# Altium schematic sheet 0173_IMVP VCCCORE_SOC_ .SchDoc
size 848 x 558 mm
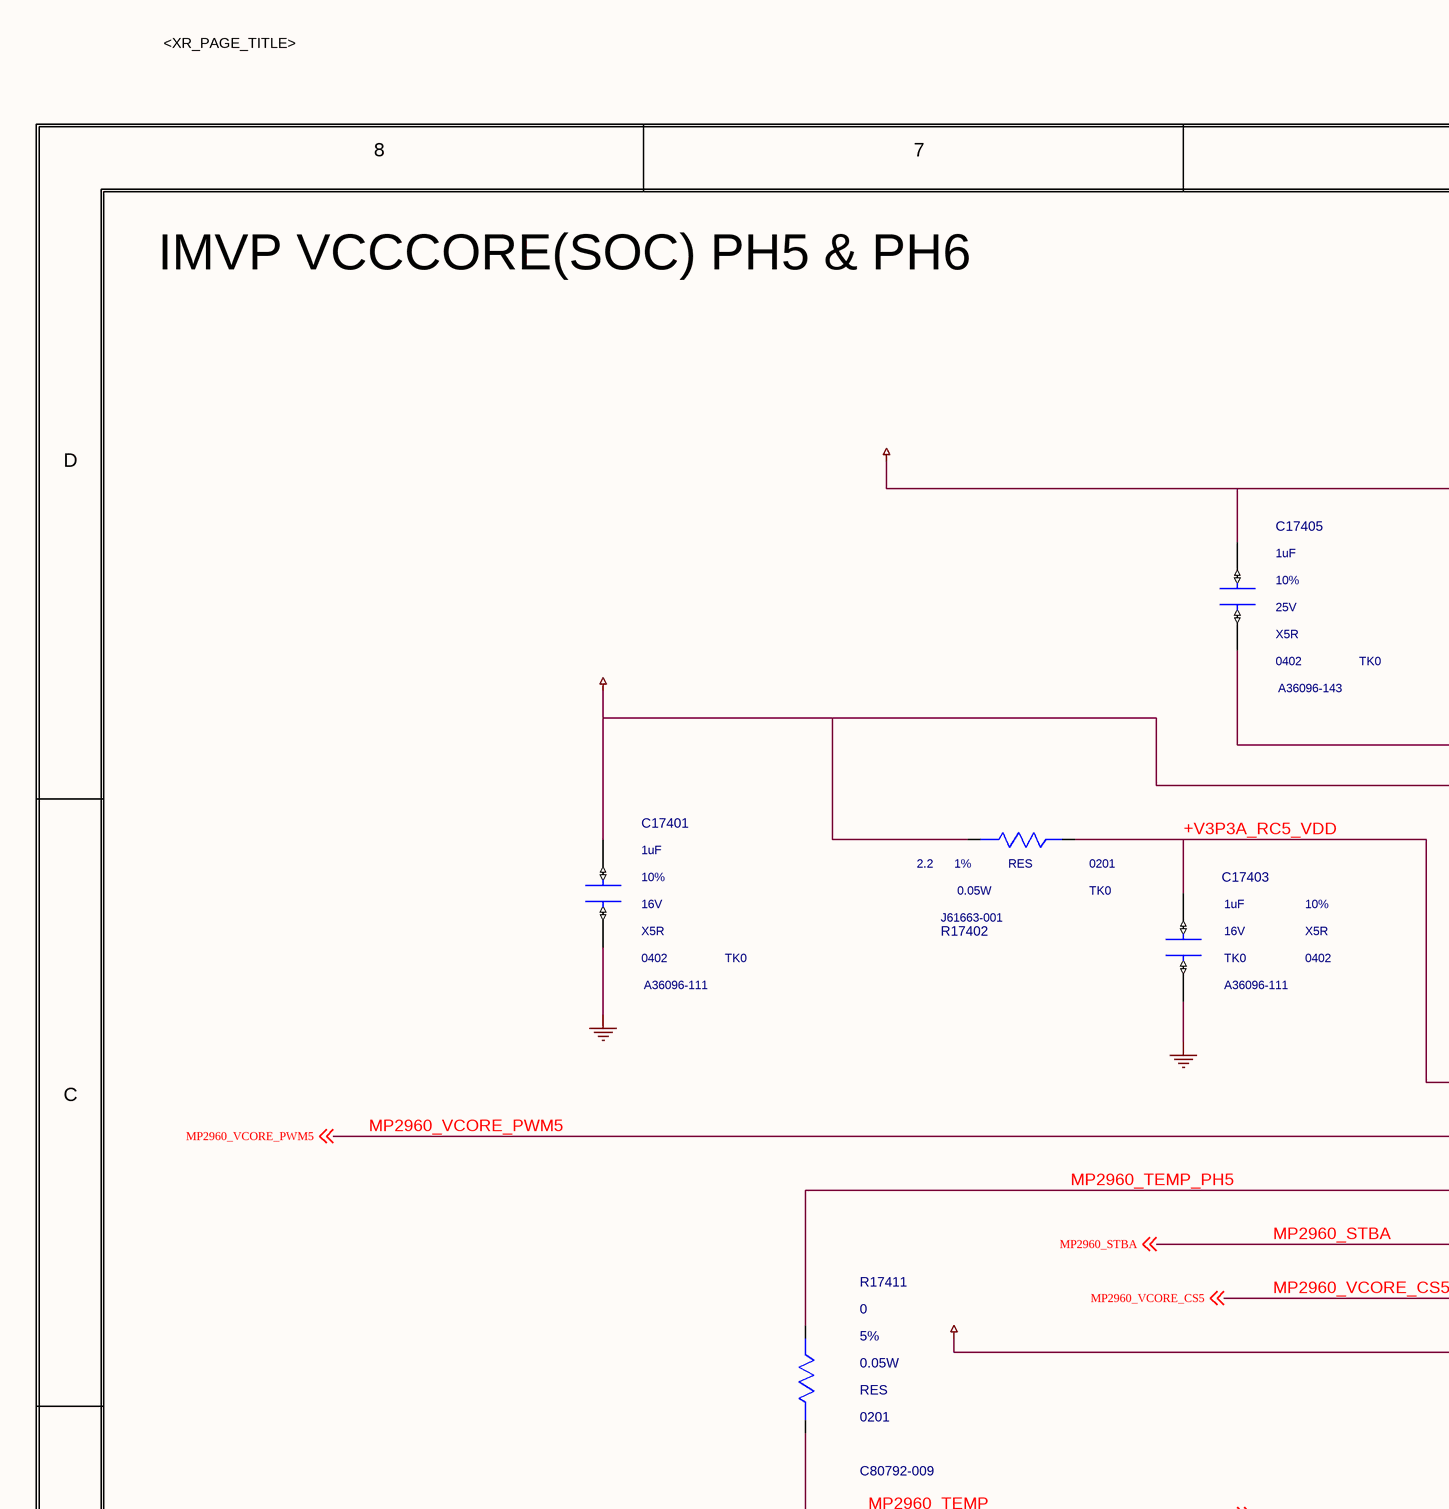
[diagram p0: 0173_IMVP VCCCORE_SOC_ .SchDoc, top left]
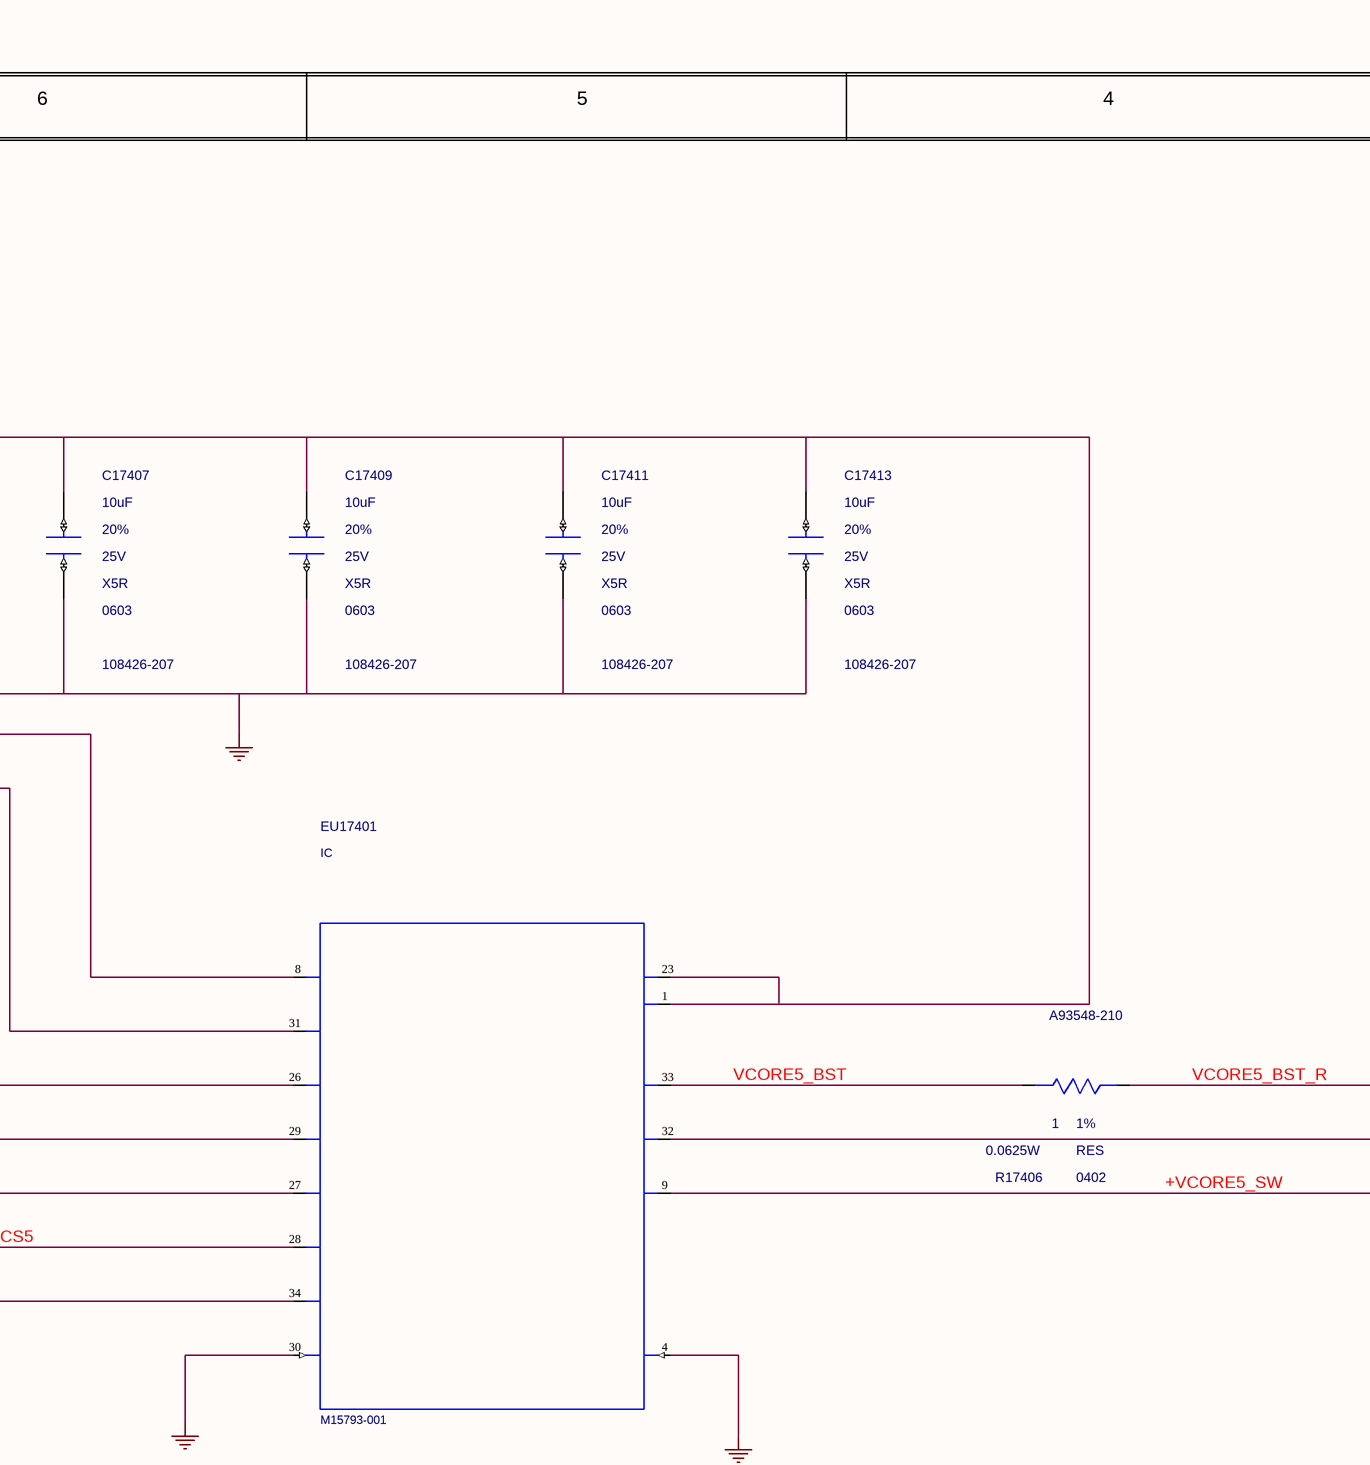
[diagram p1: 0173_IMVP VCCCORE_SOC_ .SchDoc, top middle]
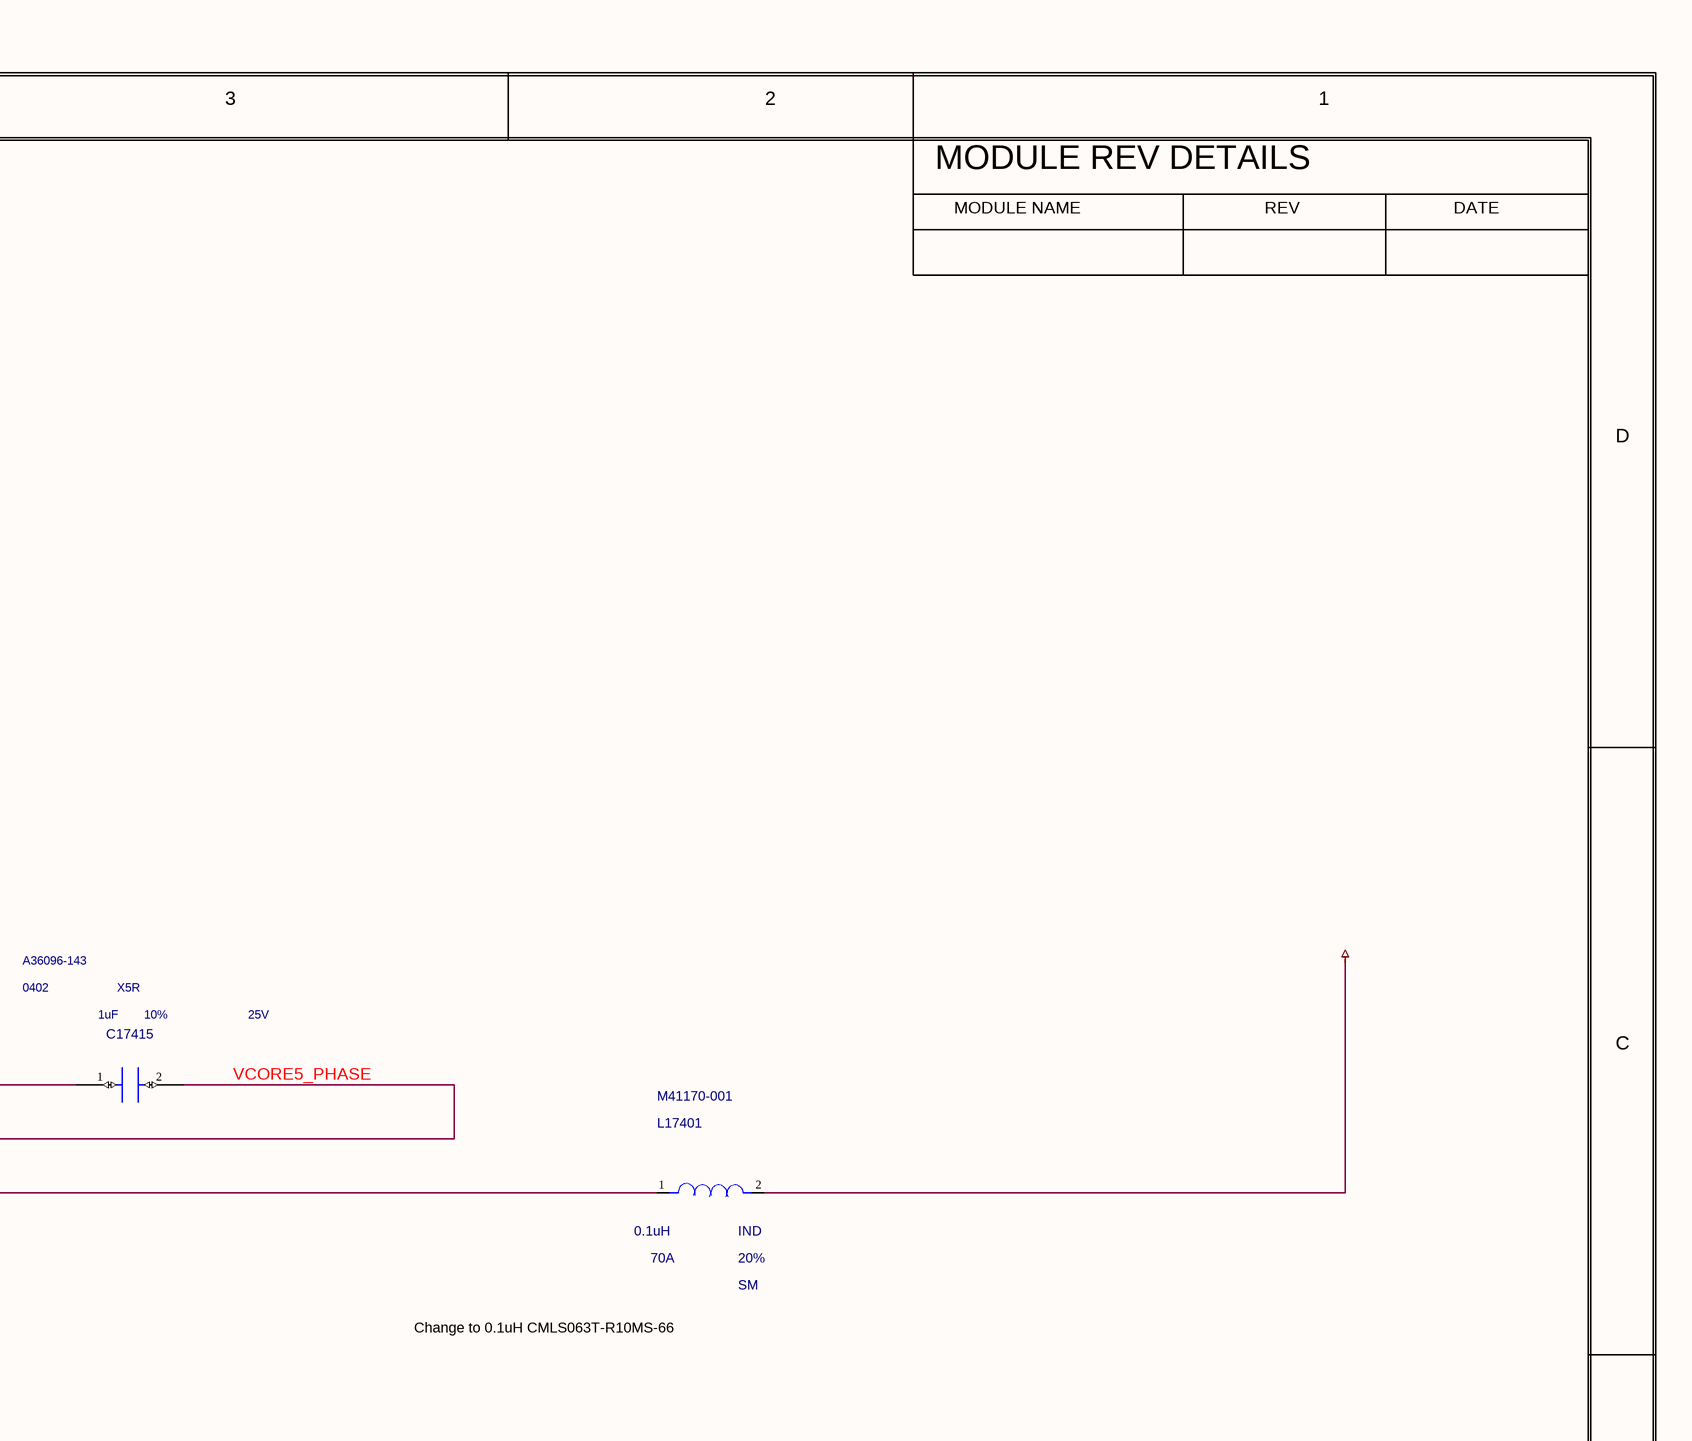
[diagram p2: 0173_IMVP VCCCORE_SOC_ .SchDoc, top right]
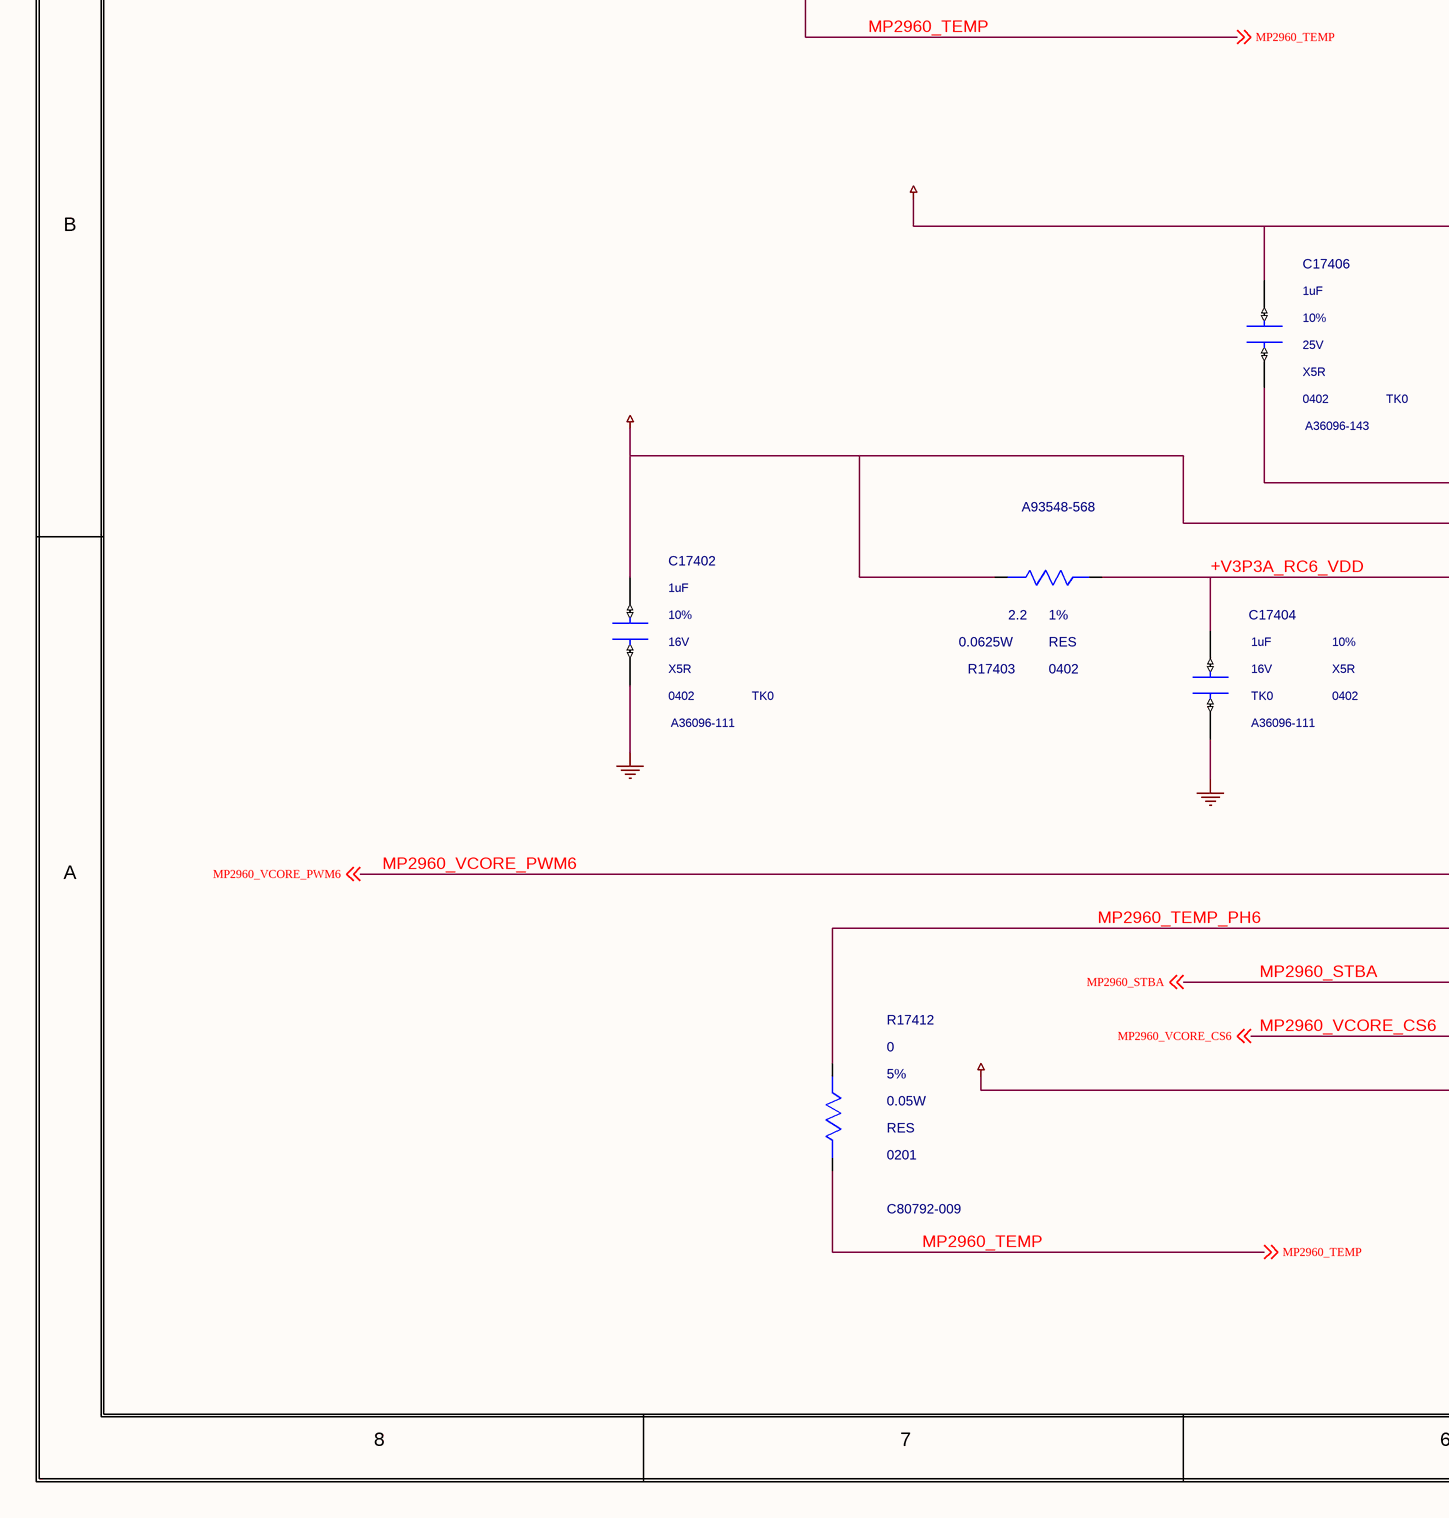
[diagram p3: 0173_IMVP VCCCORE_SOC_ .SchDoc, bottom left]
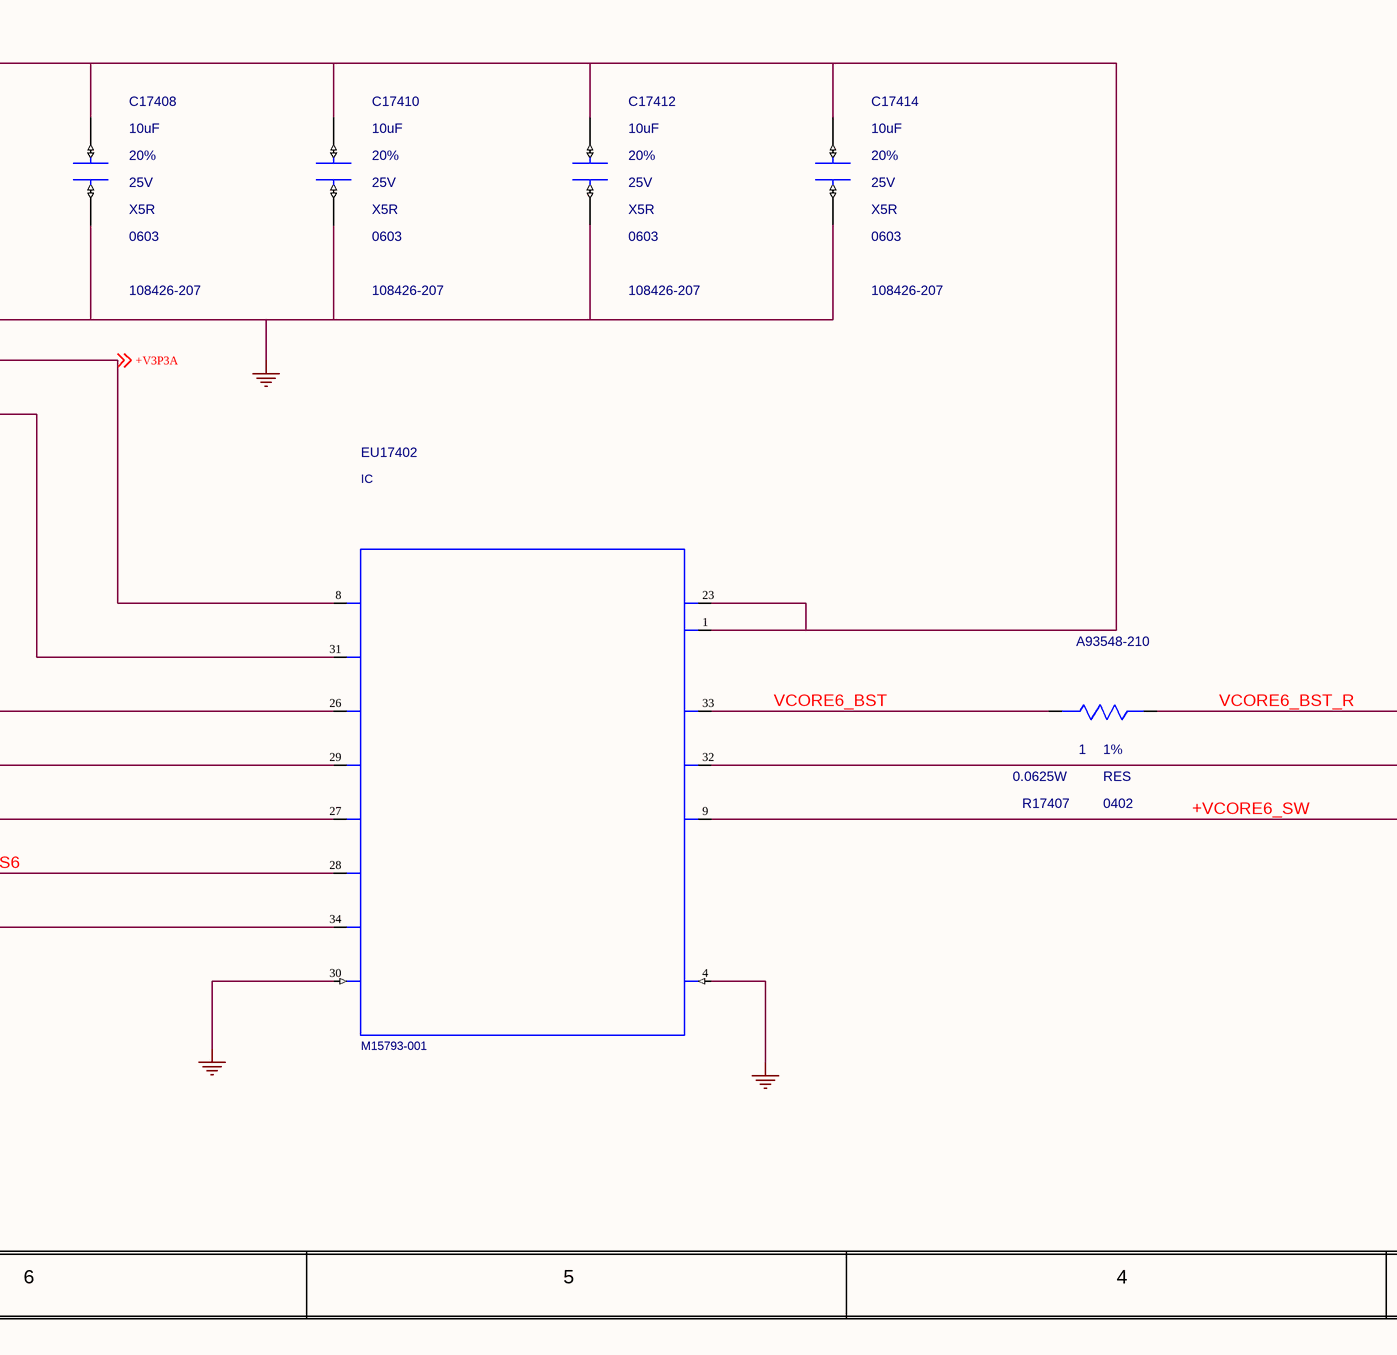
[diagram p4: 0173_IMVP VCCCORE_SOC_ .SchDoc, bottom middle]
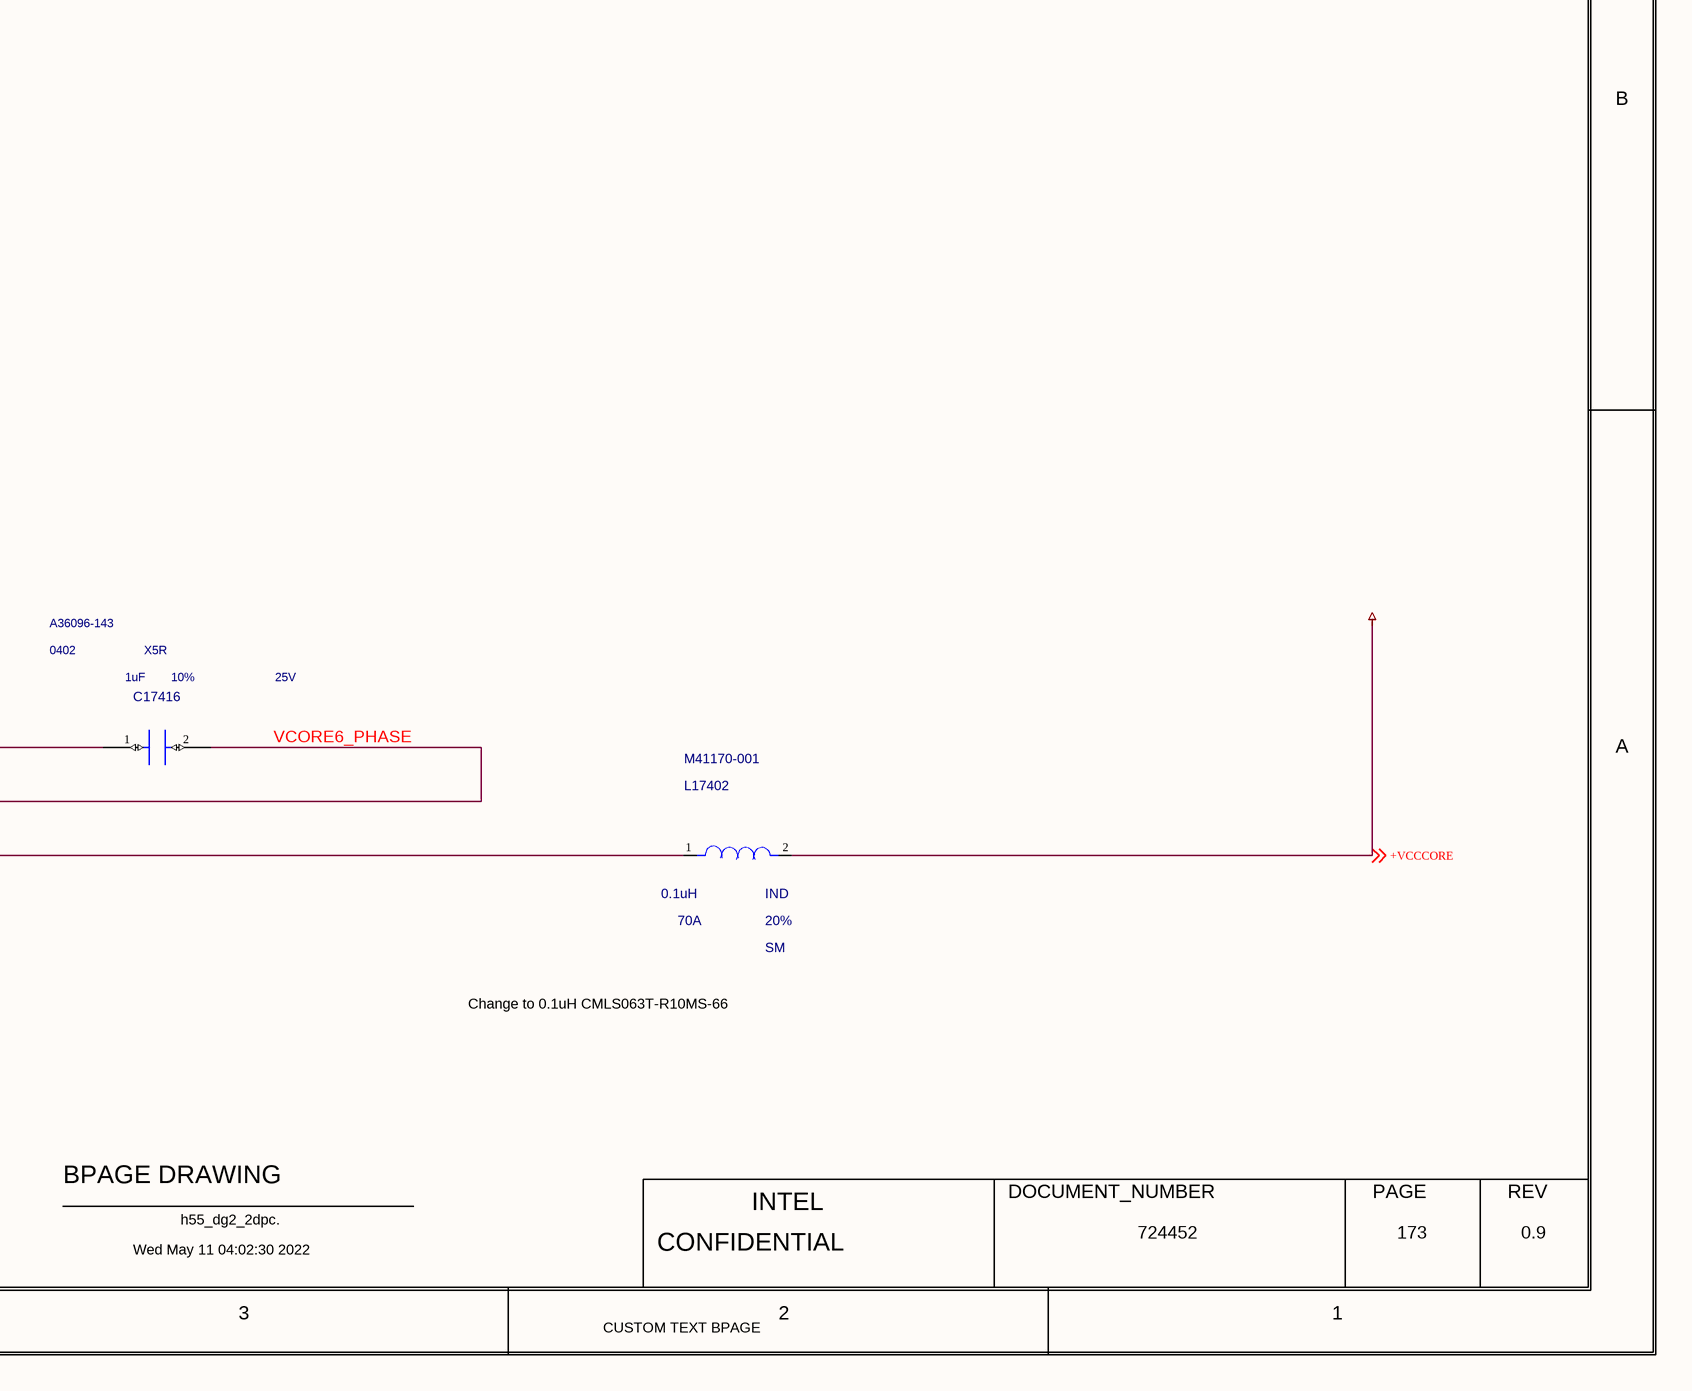
[diagram p5: 0173_IMVP VCCCORE_SOC_ .SchDoc, bottom right]

## Parts
C17401  1uF  FP_TECH: TK0  MATERIAL: X5R  PACK_TYPE: 0402  PART_NUMBER: A36096-111  TOLERANCE: 10%  VOLTAGE: 16V  [CTK0_SM0402_1050X550_MA]
C17402  1uF  FP_TECH: TK0  MATERIAL: X5R  PACK_TYPE: 0402  PART_NUMBER: A36096-111  TOLERANCE: 10%  VOLTAGE: 16V  [CTK0_SM0402_1050X550_MA]
C17403  1uF  FP_TECH: TK0  MATERIAL: X5R  PACK_TYPE: 0402  PART_NUMBER: A36096-111  TOLERANCE: 10%  VOLTAGE: 16V  [CTK0_SM0402_1050X550_MA]
C17404  1uF  FP_TECH: TK0  MATERIAL: X5R  PACK_TYPE: 0402  PART_NUMBER: A36096-111  TOLERANCE: 10%  VOLTAGE: 16V  [CTK0_SM0402_1050X550_MA]
C17405  1uF  FP_TECH: TK0  MATERIAL: X5R  PACK_TYPE: 0402  PART_NUMBER: A36096-143  TOLERANCE: 10%  VOLTAGE: 25V  [CTK0_SM0402_1050X550_MA]
C17406  1uF  FP_TECH: TK0  MATERIAL: X5R  PACK_TYPE: 0402  PART_NUMBER: A36096-143  TOLERANCE: 10%  VOLTAGE: 25V  [CTK0_SM0402_1050X550_MA]
C17407  10uF  MATERIAL: X5R  PACK_TYPE: 0603  PART_NUMBER: 108426-207  TOLERANCE: 20%  VOLTAGE: 25V  [CTK2_SM0603_1800X1000_MA]
C17408  10uF  MATERIAL: X5R  PACK_TYPE: 0603  PART_NUMBER: 108426-207  TOLERANCE: 20%  VOLTAGE: 25V  [CTK2_SM0603_1800X1000_MA]
C17409  10uF  MATERIAL: X5R  PACK_TYPE: 0603  PART_NUMBER: 108426-207  TOLERANCE: 20%  VOLTAGE: 25V  [CTK2_SM0603_1800X1000_MA]
C17410  10uF  MATERIAL: X5R  PACK_TYPE: 0603  PART_NUMBER: 108426-207  TOLERANCE: 20%  VOLTAGE: 25V  [CTK2_SM0603_1800X1000_MA]
C17411  10uF  MATERIAL: X5R  PACK_TYPE: 0603  PART_NUMBER: 108426-207  TOLERANCE: 20%  VOLTAGE: 25V  [CTK2_SM0603_1800X1000_MA]
C17412  10uF  MATERIAL: X5R  PACK_TYPE: 0603  PART_NUMBER: 108426-207  TOLERANCE: 20%  VOLTAGE: 25V  [CTK2_SM0603_1800X1000_MA]
C17413  10uF  MATERIAL: X5R  PACK_TYPE: 0603  PART_NUMBER: 108426-207  TOLERANCE: 20%  VOLTAGE: 25V  [CTK2_SM0603_1800X1000_MA]
C17414  10uF  MATERIAL: X5R  PACK_TYPE: 0603  PART_NUMBER: 108426-207  TOLERANCE: 20%  VOLTAGE: 25V  [CTK2_SM0603_1800X1000_MA]
C17415  1uF  MATERIAL: X5R  PACK_TYPE: 0402  PART_NUMBER: A36096-143  TOLERANCE: 10%  VOLTAGE: 25V  [SMC0402MA]
C17416  1uF  MATERIAL: X5R  PACK_TYPE: 0402  PART_NUMBER: A36096-143  TOLERANCE: 10%  VOLTAGE: 25V  [SMC0402MA]
EU17401  MATERIAL: IC  PART_NUMBER: M15793-001  [CTK1_LCC34_4100X6100_450_DF4P_MA_VR]  (hidden comment: C_MP86959)
EU17402  MATERIAL: IC  PART_NUMBER: M15793-001  [CTK1_LCC34_4100X6100_450_DF4P_MA_VR]  (hidden comment: C_MP86959)
L17401  0.1uH  CURRENT: 70A  MATERIAL: IND  PACK_TYPE: SM  PART_NUMBER: M41170-001  TOLERANCE: 20%  [CTK2_SM_7300X6800_MA]
L17402  0.1uH  CURRENT: 70A  MATERIAL: IND  PACK_TYPE: SM  PART_NUMBER: M41170-001  TOLERANCE: 20%  [CTK2_SM_7300X6800_MA]
R17402  2.2  FP_TECH: TK0  MATERIAL: RES  PACK_TYPE: 0201  PART_NUMBER: J61663-001  TOLERANCE: 1%  WATTAGE: 0.05W  [CTK0_SM0201_630X330_MA]
R17403  2.2  MATERIAL: RES  PACK_TYPE: 0402  PART_NUMBER: A93548-568  TOLERANCE: 1%  WATTAGE: 0.0625W  [CTK2_SM0402_1100X550_MA]
R17406  1  MATERIAL: RES  PACK_TYPE: 0402  PART_NUMBER: A93548-210  TOLERANCE: 1%  WATTAGE: 0.0625W  [CTK0_SM0402_1100X550_MA]
R17407  1  MATERIAL: RES  PACK_TYPE: 0402  PART_NUMBER: A93548-210  TOLERANCE: 1%  WATTAGE: 0.0625W  [CTK0_SM0402_1100X550_MA]
R17411  0  MATERIAL: RES  PACK_TYPE: 0201  PART_NUMBER: C80792-009  TOLERANCE: 5%  WATTAGE: 0.05W  [CTK0_SM0201_630X330_MA]
R17412  0  MATERIAL: RES  PACK_TYPE: 0201  PART_NUMBER: C80792-009  TOLERANCE: 5%  WATTAGE: 0.05W  [CTK0_SM0201_630X330_MA]

## Nets
+V3P3A: C17401.1(A) C17402.1(A) EU17401.8(VDRV) EU17401.34(TEST) EU17402.8(VDRV) EU17402.34(TEST) R17402.1(A) R17403.1(A) ; off-sheet +V3P3A
+VBATA_VCCIN: C17405.1(A) C17406.1(A) C17407.1(A) C17408.1(A) C17409.1(A) C17410.1(A) C17411.1(A) C17412.1(A) C17413.1(A) C17414.1(A) EU17401.1(VIN_1) EU17401.23(VIN_2) EU17402.1(VIN_1) EU17402.23(VIN_2)
+VCCCORE: L17401.2(INB) L17402.2(INB) ; off-sheet +VCCCORE
GND: C17401.2(B) C17402.2(B) C17403.2(B) C17404.2(B) C17405.2(B) C17406.2(B) C17407.2(B) C17408.2(B) C17409.2(B) C17410.2(B) C17411.2(B) C17412.2(B) C17413.2(B) C17414.2(B) EU17401.4(PGND) EU17401.30(AGND) EU17402.4(PGND) EU17402.30(AGND)
+V3P3A_RC5_VDD: C17403.1(A) EU17401.31(VDD) R17402.2(B)
+V3P3A_RC6_VDD: C17404.1(A) EU17402.31(VDD) R17403.2(B)
+VCORE5_SW: EU17401.9(SW) L17401.1(INA)
+VCORE6_SW: EU17402.9(SW) L17402.1(INA)
MP2960_STBA: EU17401.27(SYNC) EU17402.27(SYNC) ; off-sheet MP2960_STBA
MP2960_TEMP: R17411.2(B) R17412.2(B) ; off-sheet MP2960_TEMP
MP2960_TEMP_PH5: EU17401.29(VTEMP_FLT) R17411.1(A)
MP2960_TEMP_PH6: EU17402.29(VTEMP_FLT) R17412.1(A)
MP2960_VCORE_CS5: EU17401.28(CS) ; off-sheet MP2960_VCORE_CS5
MP2960_VCORE_CS6: EU17402.28(CS) ; off-sheet MP2960_VCORE_CS6
MP2960_VCORE_PWM5: EU17401.26(PWM) ; off-sheet MP2960_VCORE_PWM5
MP2960_VCORE_PWM6: EU17402.26(PWM) ; off-sheet MP2960_VCORE_PWM6
VCORE5_BST: EU17401.33(BST) R17406.1(A)
VCORE5_BST_R: C17415.1(A) R17406.2(B)
VCORE5_PHASE: C17415.2(B) EU17401.32(PHASE)
VCORE6_BST: EU17402.33(BST) R17407.1(A)
VCORE6_BST_R: C17416.1(A) R17407.2(B)
VCORE6_PHASE: C17416.2(B) EU17402.32(PHASE)

## Notes on the sheet
- <XR_PAGE_TITLE>
- 8
- 7
- 6
- 5
- 4
- 3
- 2
- 1
- MODULE REV DETAILS
- IMVP VCCCORE(SOC) PH5 & PH6
- MODULE NAME
- REV
- DATE
- D
- C
- Change to 0.1uH CMLS063T-R10MS-66
- B
- A
- BPAGE DRAWING
- INTEL
- DOCUMENT_NUMBER
- PAGE
- Wed May 11 04:02:30 2022
- h55_dg2_2dpc.
- CONFIDENTIAL
- 724452
- 173
- 0.9
- CUSTOM TEXT BPAGE

## Library data of the parts
C17401 = C_CAP: CDS_PHYS_PART_NAME: C_CAP_0402-A36096-111,X5R,1UF,16V,10%,TK0,GENERIC; CDS_LMAN_SYM_OUTLINE: -50,50,50,-50; IP: GENERIC; ROOM: NONE; OriginalSymbolOrigin: (-50,25); XY: (-2000,3475); VER: 1; ROT: 0; PHYS_PAGE: 173; LOCATION: C17401; DRAWING: @RVP1_ADL_SB_ADP_S_DDR5_SODIMM_2DPC_LIB.H55_DG2_2DPC(SCH_1):PAGE542; CDS_LIB: c_discrete; VARIANT: ?; PCB Footprint: CTK0_SM0402_1050X550_MA; CHIPS_PART_NAME: C_CAP; CDS_PART_NAME: C_CAP_0402-A36096-111,X5R,1UF,16V,10%,TK0,GENERIC; CDS_LOCATION: C17401
C17402 = C_CAP: CDS_PHYS_PART_NAME: C_CAP_0402-A36096-111,X5R,1UF,16V,10%,TK0,GENERIC; CDS_LMAN_SYM_OUTLINE: -50,50,50,-50; IP: GENERIC; ROOM: NONE; OriginalSymbolOrigin: (-50,25); XY: (-1950,1225); VER: 1; ROT: 0; PHYS_PAGE: 173; LOCATION: C17402; DRAWING: @RVP1_ADL_SB_ADP_S_DDR5_SODIMM_2DPC_LIB.H55_DG2_2DPC(SCH_1):PAGE542; CDS_LIB: c_discrete; VARIANT: ?; PCB Footprint: CTK0_SM0402_1050X550_MA; CHIPS_PART_NAME: C_CAP; CDS_PART_NAME: C_CAP_0402-A36096-111,X5R,1UF,16V,10%,TK0,GENERIC; CDS_LOCATION: C17402
C17403 = C_CAP: CDS_PHYS_PART_NAME: C_CAP_0402-A36096-111,X5R,1UF,16V,10%,TK0,GENERIC; CDS_LMAN_SYM_OUTLINE: -50,50,50,-50; IP: GENERIC; ROOM: NONE; OriginalSymbolOrigin: (-50,25); XY: (-925,3375); VER: 1; ROT: 0; PHYS_PAGE: 173; LOCATION: C17403; DRAWING: @RVP1_ADL_SB_ADP_S_DDR5_SODIMM_2DPC_LIB.H55_DG2_2DPC(SCH_1):PAGE542; CDS_LIB: c_discrete; VARIANT: ?; PCB Footprint: CTK0_SM0402_1050X550_MA; CHIPS_PART_NAME: C_CAP; CDS_PART_NAME: C_CAP_0402-A36096-111,X5R,1UF,16V,10%,TK0,GENERIC; CDS_LOCATION: C17403
C17404 = C_CAP: CDS_PHYS_PART_NAME: C_CAP_0402-A36096-111,X5R,1UF,16V,10%,TK0,GENERIC; CDS_LMAN_SYM_OUTLINE: -50,50,50,-50; IP: GENERIC; ROOM: NONE; OriginalSymbolOrigin: (-50,25); XY: (-875,1125); VER: 1; ROT: 0; PHYS_PAGE: 173; LOCATION: C17404; DRAWING: @RVP1_ADL_SB_ADP_S_DDR5_SODIMM_2DPC_LIB.H55_DG2_2DPC(SCH_1):PAGE542; CDS_LIB: c_discrete; VARIANT: ?; PCB Footprint: CTK0_SM0402_1050X550_MA; CHIPS_PART_NAME: C_CAP; CDS_PART_NAME: C_CAP_0402-A36096-111,X5R,1UF,16V,10%,TK0,GENERIC; CDS_LOCATION: C17404
C17405 = C_CAP: CDS_PHYS_PART_NAME: C_CAP_0402-A36096-143,X5R,1UF,25V,10%,TK0,GENERIC; CDS_LMAN_SYM_OUTLINE: -50,50,50,-50; IP: GENERIC; ROOM: NONE; OriginalSymbolOrigin: (-50,25); XY: (-825,4025); VER: 1; ROT: 0; PHYS_PAGE: 173; LOCATION: C17405; DRAWING: @RVP1_ADL_SB_ADP_S_DDR5_SODIMM_2DPC_LIB.H55_DG2_2DPC(SCH_1):PAGE542; CDS_LIB: c_discrete; VARIANT: ?; PCB Footprint: CTK0_SM0402_1050X550_MA; CHIPS_PART_NAME: C_CAP; CDS_PART_NAME: C_CAP_0402-A36096-143,X5R,1UF,25V,10%,TK0,GENERIC; CDS_LOCATION: C17405
C17406 = C_CAP: CDS_PHYS_PART_NAME: C_CAP_0402-A36096-143,X5R,1UF,25V,10%,TK0,GENERIC; CDS_LMAN_SYM_OUTLINE: -50,50,50,-50; IP: GENERIC; ROOM: NONE; OriginalSymbolOrigin: (-50,25); XY: (-775,1775); VER: 1; ROT: 0; PHYS_PAGE: 173; LOCATION: C17406; DRAWING: @RVP1_ADL_SB_ADP_S_DDR5_SODIMM_2DPC_LIB.H55_DG2_2DPC(SCH_1):PAGE542; CDS_LIB: c_discrete; VARIANT: ?; PCB Footprint: CTK0_SM0402_1050X550_MA; CHIPS_PART_NAME: C_CAP; CDS_PART_NAME: C_CAP_0402-A36096-143,X5R,1UF,25V,10%,TK0,GENERIC; CDS_LOCATION: C17406
C17407 = C_CAP: CDS_PHYS_PART_NAME: C_CAP_0603-108426-207,X5R,10UF,25V,20%,TK2,GENERIC; CDS_LMAN_SYM_OUTLINE: -50,50,50,-50; FP_TECH: TK2; IP: GENERIC; ROOM: NONE; OriginalSymbolOrigin: (-50,25); XY: (-375,4025); VER: 1; ROT: 0; PHYS_PAGE: 173; LOCATION: C17407; DRAWING: @RVP1_ADL_SB_ADP_S_DDR5_SODIMM_2DPC_LIB.H55_DG2_2DPC(SCH_1):PAGE542; CDS_LIB: c_discrete; VARIANT: ?; PCB Footprint: CTK2_SM0603_1800X1000_MA; CHIPS_PART_NAME: C_CAP; CDS_PART_NAME: C_CAP_0603-108426-207,X5R,10UF,25V,20%,TK2,GENERIC; CDS_LOCATION: C17407
C17408 = C_CAP: CDS_PHYS_PART_NAME: C_CAP_0603-108426-207,X5R,10UF,25V,20%,TK2,GENERIC; CDS_LMAN_SYM_OUTLINE: -50,50,50,-50; FP_TECH: TK2; IP: GENERIC; ROOM: NONE; OriginalSymbolOrigin: (-50,25); XY: (-325,1775); VER: 1; ROT: 0; PHYS_PAGE: 173; LOCATION: C17408; DRAWING: @RVP1_ADL_SB_ADP_S_DDR5_SODIMM_2DPC_LIB.H55_DG2_2DPC(SCH_1):PAGE542; CDS_LIB: c_discrete; VARIANT: ?; PCB Footprint: CTK2_SM0603_1800X1000_MA; CHIPS_PART_NAME: C_CAP; CDS_PART_NAME: C_CAP_0603-108426-207,X5R,10UF,25V,20%,TK2,GENERIC; CDS_LOCATION: C17408
C17409 = C_CAP: CDS_PHYS_PART_NAME: C_CAP_0603-108426-207,X5R,10UF,25V,20%,TK2,GENERIC; CDS_LMAN_SYM_OUTLINE: -50,50,50,-50; FP_TECH: TK2; IP: GENERIC; ROOM: NONE; OriginalSymbolOrigin: (-50,25); XY: (75,4025); VER: 1; ROT: 0; PHYS_PAGE: 173; LOCATION: C17409; DRAWING: @RVP1_ADL_SB_ADP_S_DDR5_SODIMM_2DPC_LIB.H55_DG2_2DPC(SCH_1):PAGE542; CDS_LIB: c_discrete; VARIANT: ?; PCB Footprint: CTK2_SM0603_1800X1000_MA; CHIPS_PART_NAME: C_CAP; CDS_PART_NAME: C_CAP_0603-108426-207,X5R,10UF,25V,20%,TK2,GENERIC; CDS_LOCATION: C17409
C17410 = C_CAP: CDS_PHYS_PART_NAME: C_CAP_0603-108426-207,X5R,10UF,25V,20%,TK2,GENERIC; CDS_LMAN_SYM_OUTLINE: -50,50,50,-50; FP_TECH: TK2; IP: GENERIC; ROOM: NONE; OriginalSymbolOrigin: (-50,25); XY: (125,1775); VER: 1; ROT: 0; PHYS_PAGE: 173; LOCATION: C17410; DRAWING: @RVP1_ADL_SB_ADP_S_DDR5_SODIMM_2DPC_LIB.H55_DG2_2DPC(SCH_1):PAGE542; CDS_LIB: c_discrete; VARIANT: ?; PCB Footprint: CTK2_SM0603_1800X1000_MA; CHIPS_PART_NAME: C_CAP; CDS_PART_NAME: C_CAP_0603-108426-207,X5R,10UF,25V,20%,TK2,GENERIC; CDS_LOCATION: C17410
C17411 = C_CAP: CDS_PHYS_PART_NAME: C_CAP_0603-108426-207,X5R,10UF,25V,20%,TK2,GENERIC; CDS_LMAN_SYM_OUTLINE: -50,50,50,-50; FP_TECH: TK2; IP: GENERIC; ROOM: NONE; OriginalSymbolOrigin: (-50,25); XY: (550,4025); VER: 1; ROT: 0; PHYS_PAGE: 173; LOCATION: C17411; DRAWING: @RVP1_ADL_SB_ADP_S_DDR5_SODIMM_2DPC_LIB.H55_DG2_2DPC(SCH_1):PAGE542; CDS_LIB: c_discrete; VARIANT: ?; PCB Footprint: CTK2_SM0603_1800X1000_MA; CHIPS_PART_NAME: C_CAP; CDS_PART_NAME: C_CAP_0603-108426-207,X5R,10UF,25V,20%,TK2,GENERIC; CDS_LOCATION: C17411
C17412 = C_CAP: CDS_PHYS_PART_NAME: C_CAP_0603-108426-207,X5R,10UF,25V,20%,TK2,GENERIC; CDS_LMAN_SYM_OUTLINE: -50,50,50,-50; FP_TECH: TK2; IP: GENERIC; ROOM: NONE; OriginalSymbolOrigin: (-50,25); XY: (600,1775); VER: 1; ROT: 0; PHYS_PAGE: 173; LOCATION: C17412; DRAWING: @RVP1_ADL_SB_ADP_S_DDR5_SODIMM_2DPC_LIB.H55_DG2_2DPC(SCH_1):PAGE542; CDS_LIB: c_discrete; VARIANT: ?; PCB Footprint: CTK2_SM0603_1800X1000_MA; CHIPS_PART_NAME: C_CAP; CDS_PART_NAME: C_CAP_0603-108426-207,X5R,10UF,25V,20%,TK2,GENERIC; CDS_LOCATION: C17412
C17413 = C_CAP: CDS_PHYS_PART_NAME: C_CAP_0603-108426-207,X5R,10UF,25V,20%,TK2,GENERIC; CDS_LMAN_SYM_OUTLINE: -50,50,50,-50; FP_TECH: TK2; IP: GENERIC; ROOM: NONE; OriginalSymbolOrigin: (-50,25); XY: (1000,4025); VER: 1; ROT: 0; PHYS_PAGE: 173; LOCATION: C17413; DRAWING: @RVP1_ADL_SB_ADP_S_DDR5_SODIMM_2DPC_LIB.H55_DG2_2DPC(SCH_1):PAGE542; CDS_LIB: c_discrete; VARIANT: ?; PCB Footprint: CTK2_SM0603_1800X1000_MA; CHIPS_PART_NAME: C_CAP; CDS_PART_NAME: C_CAP_0603-108426-207,X5R,10UF,25V,20%,TK2,GENERIC; CDS_LOCATION: C17413
C17414 = C_CAP: CDS_PHYS_PART_NAME: C_CAP_0603-108426-207,X5R,10UF,25V,20%,TK2,GENERIC; CDS_LMAN_SYM_OUTLINE: -50,50,50,-50; FP_TECH: TK2; IP: GENERIC; ROOM: NONE; OriginalSymbolOrigin: (-50,25); XY: (1050,1775); VER: 1; ROT: 0; PHYS_PAGE: 173; LOCATION: C17414; DRAWING: @RVP1_ADL_SB_ADP_S_DDR5_SODIMM_2DPC_LIB.H55_DG2_2DPC(SCH_1):PAGE542; CDS_LIB: c_discrete; VARIANT: ?; PCB Footprint: CTK2_SM0603_1800X1000_MA; CHIPS_PART_NAME: C_CAP; CDS_PART_NAME: C_CAP_0603-108426-207,X5R,10UF,25V,20%,TK2,GENERIC; CDS_LOCATION: C17414
C17415 = CAP#1: CHIPS_PART_NAME: CAP; CDS_PHYS_PART_NAME: CAP_0402-A36096-143,X5R,1UF,25V,10%,LPDB,GENERIC; OriginalSymbolOrigin: (-25,50); XY: (2375,3025); VER: 2; ROT: 0; PHYS_PAGE: 173; LOCATION: C17415; DRAWING: @RVP1_ADL_SB_ADP_S_DDR5_SODIMM_2DPC_LIB.H55_DG2_2DPC(SCH_1):PAGE542; CDS_LIB: discrete; PCB Footprint: SMC0402MA; CDS_PART_NAME: CAP_0402-A36096-143,X5R,1UF,25V,10%,LPDB,GENERIC; CDS_LOCATION: C17415
C17416 = CAP#1: CHIPS_PART_NAME: CAP; CDS_PHYS_PART_NAME: CAP_0402-A36096-143,X5R,1UF,25V,10%,LPDB,GENERIC; OriginalSymbolOrigin: (-25,50); XY: (2425,775); VER: 2; ROT: 0; PHYS_PAGE: 173; LOCATION: C17416; DRAWING: @RVP1_ADL_SB_ADP_S_DDR5_SODIMM_2DPC_LIB.H55_DG2_2DPC(SCH_1):PAGE542; CDS_LIB: discrete; PCB Footprint: SMC0402MA; CDS_PART_NAME: CAP_0402-A36096-143,X5R,1UF,25V,10%,LPDB,GENERIC; CDS_LOCATION: C17416
EU17401 = C_MP86959: CDS_PHYS_PART_NAME: C_MP86959_LCC-M15793-001,IC,MP86959GMW,TK1,GENERIC; CDS_LMAN_SYM_OUTLINE: -300,450,300,-450; FP_TECH: TK1; IP: GENERIC; PACK_TYPE: LCC; ROOM: NONE; OriginalSymbolOrigin: (-325,450); XY: (400,2875); VER: 1; ROT: 0; PHYS_PAGE: 173; LOCATION: EU17401; DRAWING: @RVP1_ADL_SB_ADP_S_DDR5_SODIMM_2DPC_LIB.H55_DG2_2DPC(SCH_1):PAGE542; CDS_LIB: local; VARIANT: ?; PCB Footprint: CTK1_LCC34_4100X6100_450_DF4P_MA_VR; CHIPS_PART_NAME: C_MP86959; CDS_PART_NAME: C_MP86959_LCC-M15793-001,IC,MP86959GMW,TK1,GENERIC; CDS_LOCATION: EU17401
EU17402 = C_MP86959: CDS_PHYS_PART_NAME: C_MP86959_LCC-M15793-001,IC,MP86959GMW,TK1,GENERIC; CDS_LMAN_SYM_OUTLINE: -300,450,300,-450; FP_TECH: TK1; IP: GENERIC; PACK_TYPE: LCC; ROOM: NONE; OriginalSymbolOrigin: (-325,450); XY: (475,625); VER: 1; ROT: 0; PHYS_PAGE: 173; LOCATION: EU17402; DRAWING: @RVP1_ADL_SB_ADP_S_DDR5_SODIMM_2DPC_LIB.H55_DG2_2DPC(SCH_1):PAGE542; CDS_LIB: local; VARIANT: ?; PCB Footprint: CTK1_LCC34_4100X6100_450_DF4P_MA_VR; CHIPS_PART_NAME: C_MP86959; CDS_PART_NAME: C_MP86959_LCC-M15793-001,IC,MP86959GMW,TK1,GENERIC; CDS_LOCATION: EU17402
L17401 = C_INDUCTOR: CDS_PHYS_PART_NAME: C_INDUCTOR_SM-M41170-001,IND,0.1UH,20%,70A,TK2,GENERIC; CDS_LMAN_SYM_OUTLINE: -100,50,100,-50; FP_TECH: TK2; IP: GENERIC; ROOM: NONE; OriginalSymbolOrigin: (-75,25); XY: (3450,2825); VER: 1; ROT: 0; PHYS_PAGE: 173; LOCATION: L17401; DRAWING: @RVP1_ADL_SB_ADP_S_DDR5_SODIMM_2DPC_LIB.H55_DG2_2DPC(SCH_1):PAGE542; CDS_LIB: local; VARIANT: ?; PCB Footprint: CTK2_SM_7300X6800_MA; CHIPS_PART_NAME: C_INDUCTOR; CDS_PART_NAME: C_INDUCTOR_SM-M41170-001,IND,0.1UH,20%,70A,TK2,GENERIC; CDS_LOCATION: L17401
L17402 = C_INDUCTOR: CDS_PHYS_PART_NAME: C_INDUCTOR_SM-M41170-001,IND,0.1UH,20%,70A,TK2,GENERIC; CDS_LMAN_SYM_OUTLINE: -100,50,100,-50; FP_TECH: TK2; IP: GENERIC; ROOM: NONE; OriginalSymbolOrigin: (-75,25); XY: (3500,575); VER: 1; ROT: 0; PHYS_PAGE: 173; LOCATION: L17402; DRAWING: @RVP1_ADL_SB_ADP_S_DDR5_SODIMM_2DPC_LIB.H55_DG2_2DPC(SCH_1):PAGE542; CDS_LIB: local; VARIANT: ?; PCB Footprint: CTK2_SM_7300X6800_MA; CHIPS_PART_NAME: C_INDUCTOR; CDS_PART_NAME: C_INDUCTOR_SM-M41170-001,IND,0.1UH,20%,70A,TK2,GENERIC; CDS_LOCATION: L17402
R17402 = C_RES#1: CHIPS_PART_NAME: C_RES; CDS_PHYS_PART_NAME: C_RES_0201-J61663-001,RES,2.2,1%,0.05W,TK0,GENERIC; CDS_LMAN_SYM_OUTLINE: -50,50,50,-50; IP: GENERIC; ROOM: NONE; OriginalSymbolOrigin: (-75,25); XY: (-1225,3575); VER: 1; ROT: 0; PHYS_PAGE: 173; LOCATION: R17402; DRAWING: @RVP1_ADL_SB_ADP_S_DDR5_SODIMM_2DPC_LIB.H55_DG2_2DPC(SCH_1):PAGE542; CDS_LIB: c_discrete; VARIANT: ?; PCB Footprint: CTK0_SM0201_630X330_MA; CDS_PART_NAME: C_RES_0201-J61663-001,RES,2.2,1%,0.05W,TK0,GENERIC; CDS_LOCATION: R17402
R17403 = C_RES#1: CHIPS_PART_NAME: C_RES; CDS_PHYS_PART_NAME: C_RES_0402-A93548-568,RES,2.2,1%,0.0625W,TK2,GENERIC; CDS_LMAN_SYM_OUTLINE: -50,50,50,-50; FP_TECH: TK2; IP: GENERIC; ROOM: NONE; OriginalSymbolOrigin: (-75,25); XY: (-1175,1325); VER: 1; ROT: 0; PHYS_PAGE: 173; LOCATION: R17403; DRAWING: @RVP1_ADL_SB_ADP_S_DDR5_SODIMM_2DPC_LIB.H55_DG2_2DPC(SCH_1):PAGE542; CDS_LIB: c_discrete; VARIANT: ?; PCB Footprint: CTK2_SM0402_1100X550_MA; CDS_PART_NAME: C_RES_0402-A93548-568,RES,2.2,1%,0.0625W,TK2,GENERIC; CDS_LOCATION: R17403
R17406 = C_RES#1: CHIPS_PART_NAME: C_RES; CDS_PHYS_PART_NAME: C_RES_0402-A93548-210,RES,1,1%,0.0625W,TK0,GENERIC; CDS_LMAN_SYM_OUTLINE: -50,50,50,-50; FP_TECH: TK0; IP: GENERIC; ROOM: NONE; OriginalSymbolOrigin: (-75,25); XY: (1500,3025); ROT: 0; PHYS_PAGE: 173; LOCATION: R17406; DRAWING: @RVP1_ADL_SB_ADP_S_DDR5_SODIMM_2DPC_LIB.H55_DG2_2DPC(SCH_1):PAGE542; CDS_LIB: c_discrete; VARIANT: ?; PCB Footprint: CTK0_SM0402_1100X550_MA; VER: 1; CDS_PART_NAME: C_RES_0402-A93548-210,RES,1,1%,0.0625W,TK0,GENERIC; CDS_LOCATION: R17406
R17407 = C_RES#1: CHIPS_PART_NAME: C_RES; CDS_PHYS_PART_NAME: C_RES_0402-A93548-210,RES,1,1%,0.0625W,TK0,GENERIC; CDS_LMAN_SYM_OUTLINE: -50,50,50,-50; FP_TECH: TK0; IP: GENERIC; ROOM: NONE; OriginalSymbolOrigin: (-75,25); XY: (1550,775); ROT: 0; PHYS_PAGE: 173; LOCATION: R17407; DRAWING: @RVP1_ADL_SB_ADP_S_DDR5_SODIMM_2DPC_LIB.H55_DG2_2DPC(SCH_1):PAGE542; CDS_LIB: c_discrete; VARIANT: ?; PCB Footprint: CTK0_SM0402_1100X550_MA; VER: 1; CDS_PART_NAME: C_RES_0402-A93548-210,RES,1,1%,0.0625W,TK0,GENERIC; CDS_LOCATION: R17407
R17411 = C_RES: CDS_PHYS_PART_NAME: C_RES_0201-C80792-009,RES,0,5%,0.05W,TK0,GENERIC; CDS_LMAN_SYM_OUTLINE: -50,50,50,-50; FP_TECH: TK0; IP: GENERIC; ROOM: NONE; OriginalSymbolOrigin: (-25,75); XY: (-1625,2575); VER: 2; PHYS_PAGE: 173; LOCATION: R17411; DRAWING: @RVP1_ADL_SB_ADP_S_DDR5_SODIMM_2DPC_LIB.H55_DG2_2DPC(SCH_1):PAGE542; CDS_LIB: c_discrete; VARIANT: ?; PCB Footprint: CTK0_SM0201_630X330_MA; ROT: 0; CHIPS_PART_NAME: C_RES; CDS_PART_NAME: C_RES_0201-C80792-009,RES,0,5%,0.05W,TK0,GENERIC; CDS_LOCATION: R17411
R17412 = C_RES: CDS_PHYS_PART_NAME: C_RES_0201-C80792-009,RES,0,5%,0.05W,TK0,GENERIC; CDS_LMAN_SYM_OUTLINE: -50,50,50,-50; FP_TECH: TK0; IP: GENERIC; ROOM: NONE; OriginalSymbolOrigin: (-25,75); XY: (-1575,325); VER: 2; PHYS_PAGE: 173; LOCATION: R17412; DRAWING: @RVP1_ADL_SB_ADP_S_DDR5_SODIMM_2DPC_LIB.H55_DG2_2DPC(SCH_1):PAGE542; CDS_LIB: c_discrete; VARIANT: ?; PCB Footprint: CTK0_SM0201_630X330_MA; ROT: 0; CHIPS_PART_NAME: C_RES; CDS_PART_NAME: C_RES_0201-C80792-009,RES,0,5%,0.05W,TK0,GENERIC; CDS_LOCATION: R17412